# Altium schematic sheet FMC_connector_CD.SchDoc: FMC Connector CD
size A; Author: James Thomas; CompanyName: BYUI; DrawnBy: James Thomas; Engineer: James Thomas; Organization: CSEE; DocumentNumber: 5; Revision: 0.0.1; SheetNumber: 5; SheetTotal: 15
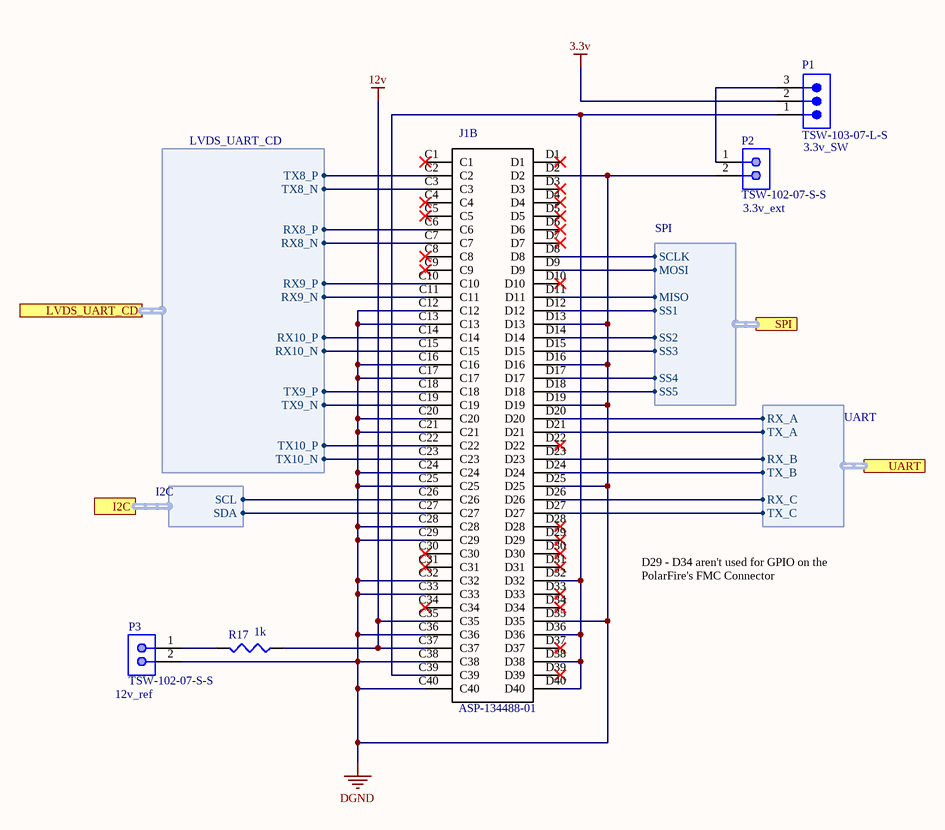
[diagram p0: FMC_connector_CD.SchDoc]

## Parts
J1  ASP-134488-01  [*SAMTEC_ASP-134488-01_ASP-134488-01(Primary)]  (part B of 5)
P1  TSW-103-07-L-S  [SMTC-TSW-103-07-X-S]
P2  TSW-102-07-S-S  [SMTC-TSW-102-07-S-S]
P3  TSW-102-07-S-S  [SMTC-TSW-102-07-S-S]
R17  value 1k  [J1-0603]  (hidden comment: Res3)

## Ports
I2C (harness I2C), LVDS_UART_CD (harness LVDS_UART_CD), SPI (harness SPI), UART (harness UART)

## Harnesses
I2C: SCL, SDA
SPI: SS1, SS2, MOSI, MISO, SCLK, SS3, SS4, SS5
UART: RX_A, TX_A, RX_B, TX_B, RX_C, TX_C
LVDS_UART_CD: TX8_P, TX8_N, RX8_P, RX8_N, RX9_N, RX9_P, TX10_P, TX10_N, TX9_P, TX9_N, RX10_P, RX10_N

## Nets
3.3v: P1.2
12v: J1.C35 J1.C37 R17.1
DGND: J1.C12 J1.C13 J1.C16 J1.C17 J1.C20 J1.C21 J1.C24 J1.C25 J1.C28 J1.C29 J1.C32 J1.C33 J1.C36 J1.C38 J1.C40 J1.D2 J1.D13 J1.D16 J1.D19 J1.D25 J1.D35 P2.2 P3.2
NetJ1_C2: J1.C2 ; port LVDS_UART_CD.TX8_P
NetJ1_C3: J1.C3 ; port LVDS_UART_CD.TX8_N
NetJ1_C6: J1.C6 ; port LVDS_UART_CD.RX8_P
NetJ1_C7: J1.C7 ; port LVDS_UART_CD.RX8_N
NetJ1_C10: J1.C10 ; port LVDS_UART_CD.RX9_P
NetJ1_C11: J1.C11 ; port LVDS_UART_CD.RX9_N
NetJ1_C14: J1.C14 ; port LVDS_UART_CD.RX10_P
NetJ1_C15: J1.C15 ; port LVDS_UART_CD.RX10_N
NetJ1_C18: J1.C18 ; port LVDS_UART_CD.TX9_P
NetJ1_C19: J1.C19 ; port LVDS_UART_CD.TX9_N
NetJ1_C22: J1.C22 ; port LVDS_UART_CD.TX10_P
NetJ1_C23: J1.C23 ; port LVDS_UART_CD.TX10_N
NetJ1_C26: J1.C26 ; port I2C.SCL
NetJ1_C27: J1.C27 ; port I2C.SDA
NetJ1_C39: J1.C39 J1.D32 J1.D36 J1.D38 J1.D40 P1.1
NetJ1_D8: J1.D8 ; port SPI.SCLK
NetJ1_D9: J1.D9 ; port SPI.MOSI
NetJ1_D11: J1.D11 ; port SPI.MISO
NetJ1_D12: J1.D12 ; port SPI.SS1
NetJ1_D14: J1.D14 ; port SPI.SS2
NetJ1_D15: J1.D15 ; port SPI.SS3
NetJ1_D17: J1.D17 ; port SPI.SS4
NetJ1_D18: J1.D18 ; port SPI.SS5
NetJ1_D20: J1.D20 ; port UART.RX_A
NetJ1_D21: J1.D21 ; port UART.TX_A
NetJ1_D23: J1.D23 ; port UART.RX_B
NetJ1_D24: J1.D24 ; port UART.TX_B
NetJ1_D26: J1.D26 ; port UART.RX_C
NetJ1_D27: J1.D27 ; port UART.TX_C
NetP1_3: P1.3 P2.1
NetP3_1: P3.1 R17.2

Not connected (* = marked no-connect by the designer): J1 C1* C4* C5* C8* C9* C30* C31* C34* D1* D3* D4* D5* D6* D7* D10* D22* D28* D29* D30* D31* D33* D34* D37* D39*

## Notes on the sheet
- (near P2) 3.3v_ext
- (near P1) 3.3v_SW
- D29 - D34 aren't used for GPIO on the PolarFire's FMC Connector
- (near P3) 12v_ref

## Library data of the parts
J1 = ASP-134488-01: Male FMC HPC Connector; SnapEDA_Link: https://www.snapeda.com/parts/ASP-134488-01/Samtec%20Inc./view-part/423215/?ref=snap; Value: *
P1 = CMP-1024-00334-1: 0.025" SQ Post Header, Through-hole, Vertical, -55 to 125 degC, 2.54 mm Pitch, 3-Pin, Male, RoHS; Manufacturer: Samtec; Pitch: 2.54 mm; Mounting Technology: Through-hole; ComponentLink2URL: http://www.samtec.com/documents/webfiles/pdf/TSW_TH.PDF; ComponentLink3Description: Package Specification; PackageVersion: DM, 8/1988; PartNumber: TSW-103-07-L-S; PackageReference: TSW-103-07-X-S; Orientation: Vertical; ComponentLink1URL: http://www.samtec.com; PackageDescription: .025[0.64] SQ. Post Terminal Strip Assembly; ComponentLink1Description: Manufacturer URL; ComponentLink2Description: Datasheet; ComponentLink3URL: http://www.samtec.com/documents/webfiles/cpdf/TSW-XXX-XX-XXX-X-XX-XXX-MKT.pdf; RoHS: True; DatasheetVersion: F-214; Temperature Range: -55 to 125 degC
P2 P3 = CMP-1681-00004-4: Male Header, Pitch 2.54 mm, 1 x 2 Position, Height 8.38 mm, Tail Length 2.54 mm, -55 to 125 degC, RoHS, Bulk; Manufacturer: Samtec; Rows: 1; ComponentLink1URL: http://www.samtec.com/; Contact Finish: Gold; Mounting Technology: Through Hole; PackageReference: TSW-102-07-S-S; RoHSCompliant: true; Pins: 2; Contact Material: Bronze; ComponentLink2Description: Datasheet; Max Operating Temperature: 125 degC; Min Operating Temperature: -55 degC; Height: 8.38 mm; Packaging: Bulk; ComponentLink1Description: Manufacturer URL; PackageDescription: Male Header, Pitch 2.54 mm, 1 x 2 Position, Height 8.38 mm, Tail Length 2.54 mm; Colour: Black; Contact Plating: Gold; Length: 5.08 mm; ComponentLink2URL: http://suddendocs.samtec.com/catalog_english/tsw_th.pdf; DatasheetVersion: 12/2015; Mount: Through Hole; Lead Pitch: 0.1 inch; REACH SVHC: No SVHC; Package Quantity: 1
R17 = Res3: Resistor; Published: 8-Jun-2000; LatestRevisionDate: 29-May-2009; LatestRevisionNote: IPC-7351 Footprint Added.; PackageReference: J1-0603; Publisher: Altium Limited; PackageDescription: Chip Resistor